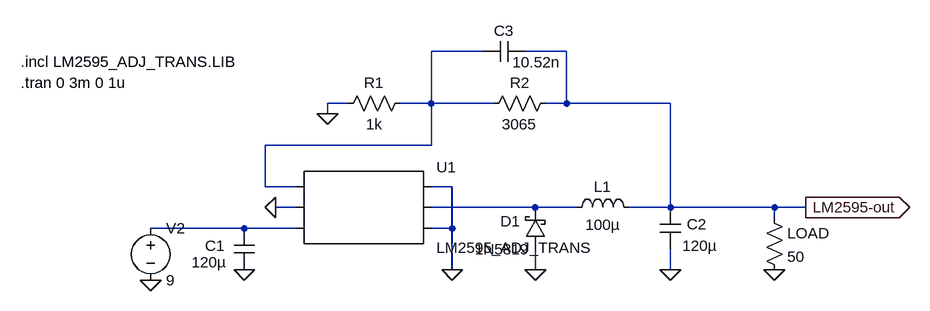
[diagram p0: schematic voltageRegulators.asc]
voltageRegulators.asc, the LTspice schematic file:
Version 4
SHEET 1 1600 1236
WIRE 768 144 688 144
WIRE 896 144 832 144
WIRE 560 224 528 224
WIRE 688 224 688 144
WIRE 688 224 640 224
WIRE 784 224 688 224
WIRE 896 224 896 144
WIRE 896 224 864 224
WIRE 1056 224 896 224
WIRE 528 240 528 224
WIRE 688 288 688 224
WIRE 688 288 432 288
WIRE 432 352 432 288
WIRE 480 352 432 352
WIRE 720 352 688 352
WIRE 480 384 448 384
WIRE 848 384 688 384
WIRE 912 384 848 384
WIRE 1056 384 1056 224
WIRE 1056 384 992 384
WIRE 1216 384 1056 384
WIRE 1264 384 1216 384
WIRE 1216 400 1216 384
WIRE 400 416 256 416
WIRE 480 416 400 416
WIRE 720 416 720 352
WIRE 720 416 688 416
WIRE 720 480 720 416
WIRE 848 480 848 448
WIRE 1056 480 1056 448
FLAG 720 480 0
FLAG 848 480 0
FLAG 1056 480 0
FLAG 400 480 0
FLAG 448 384 0
FLAG 528 240 0
FLAG 1264 384 LM2595-out
IOPIN 1264 384 Out
FLAG 256 496 0
FLAG 1216 480 0
SYMBOL cap 384 416 R0
WINDOW 3 -65 52 Left 2
WINDOW 0 -44 27 Left 2
SYMATTR Value 120µ
SYMATTR InstName C1
SYMBOL cap 1040 384 R0
WINDOW 0 41 26 Left 2
WINDOW 3 34 59 Left 2
SYMATTR InstName C2
SYMATTR Value 120µ
SYMBOL schottky 864 448 R180
WINDOW 0 39 43 Left 2
WINDOW 3 24 0 Left 2
SYMATTR InstName D1
SYMATTR Value 1N5819
SYMBOL ind 896 400 R270
WINDOW 0 32 56 VTop 2
WINDOW 3 5 56 VBottom 2
SYMATTR InstName L1
SYMATTR Value 100µ
SYMBOL cap 832 128 R90
WINDOW 0 0 32 VBottom 2
WINDOW 3 17 -18 VTop 2
SYMATTR InstName C3
SYMATTR Value 10.52n
SYMBOL res 656 208 R90
WINDOW 0 0 56 VBottom 2
WINDOW 3 32 56 VTop 2
SYMATTR InstName R1
SYMATTR Value 1k
SYMBOL res 880 208 R90
WINDOW 0 0 56 VBottom 2
WINDOW 3 32 56 VTop 2
SYMATTR InstName R2
SYMATTR Value 3065
SYMBOL voltage 256 400 R0
WINDOW 123 0 0 Left 0
WINDOW 39 0 0 Left 0
SYMATTR InstName V2
SYMATTR Value 9
SYMBOL res 1200 384 R0
SYMATTR InstName LOAD
SYMATTR Value 50
SYMBOL AutoGenerated\\LM2595_ADJ_TRANS 576 384 R0
SYMATTR InstName U1
TEXT 56 160 Left 2 !.incl LM2595_ADJ_TRANS.LIB
TEXT 56 192 Left 2 !.tran 0 3m 0 1u

The netlist it stands for:
* voltageRegulators.asc
C1 N003 0 120µ
C2 LM2595-out 0 120µ
D1 0 N002 1N5819
L1 N002 LM2595-out 100µ
C3 LM2595-out N001 10.52n
R1 N001 0 1k
R2 LM2595-out N001 3065
V2 N003 0 9
R§LOAD LM2595-out 0 50
* U1: LM2595_ADJ_TRANS (symbol AutoGenerated\LM2595_ADJ_TRANS not available, pins judged from their places): pin1=N001 pin2=0 pin3=N003 pin4=0 pin5=N002 pin6=0
.model D D
.lib standard.dio
.incl LM2595_ADJ_TRANS.LIB
.tran 0 3m 0 1u
.backanno
.end